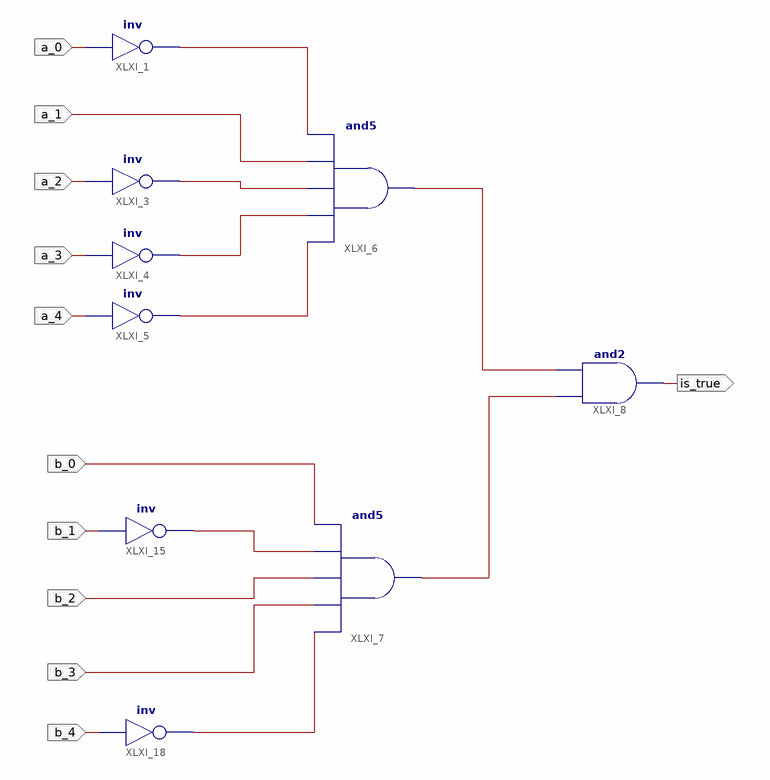
[diagram p0: schematic sheet 1]
// Xilinx ISE schematic check_13_and_2.sch (spartan3adsp) as structural Verilog: 9 symbols, 11 ports
module check_13_and_2 (
  input  a_0,
  input  a_1,
  input  a_2,
  input  a_3,
  input  a_4,
  input  b_0,
  input  b_1,
  input  b_2,
  input  b_3,
  input  b_4,
  output is_true
);

  wire XLXN_6, XLXN_8, XLXN_9, XLXN_10, XLXN_11, XLXN_12, XLXN_29, XLXN_33;

  not XLXI_1 (XLXN_6, a_0);
  not XLXI_3 (XLXN_8, a_2);
  not XLXI_4 (XLXN_9, a_3);
  not XLXI_5 (XLXN_10, a_4);
  and XLXI_6 (XLXN_11, XLXN_10, XLXN_9, XLXN_8, a_1, XLXN_6);
  and XLXI_7 (XLXN_12, XLXN_33, b_3, b_2, XLXN_29, b_0);
  and XLXI_8 (is_true, XLXN_12, XLXN_11);
  not XLXI_15 (XLXN_29, b_1);
  not XLXI_18 (XLXN_33, b_4);
endmodule
